# EAGLE design Nu_Duo (EAGLE 6.3)
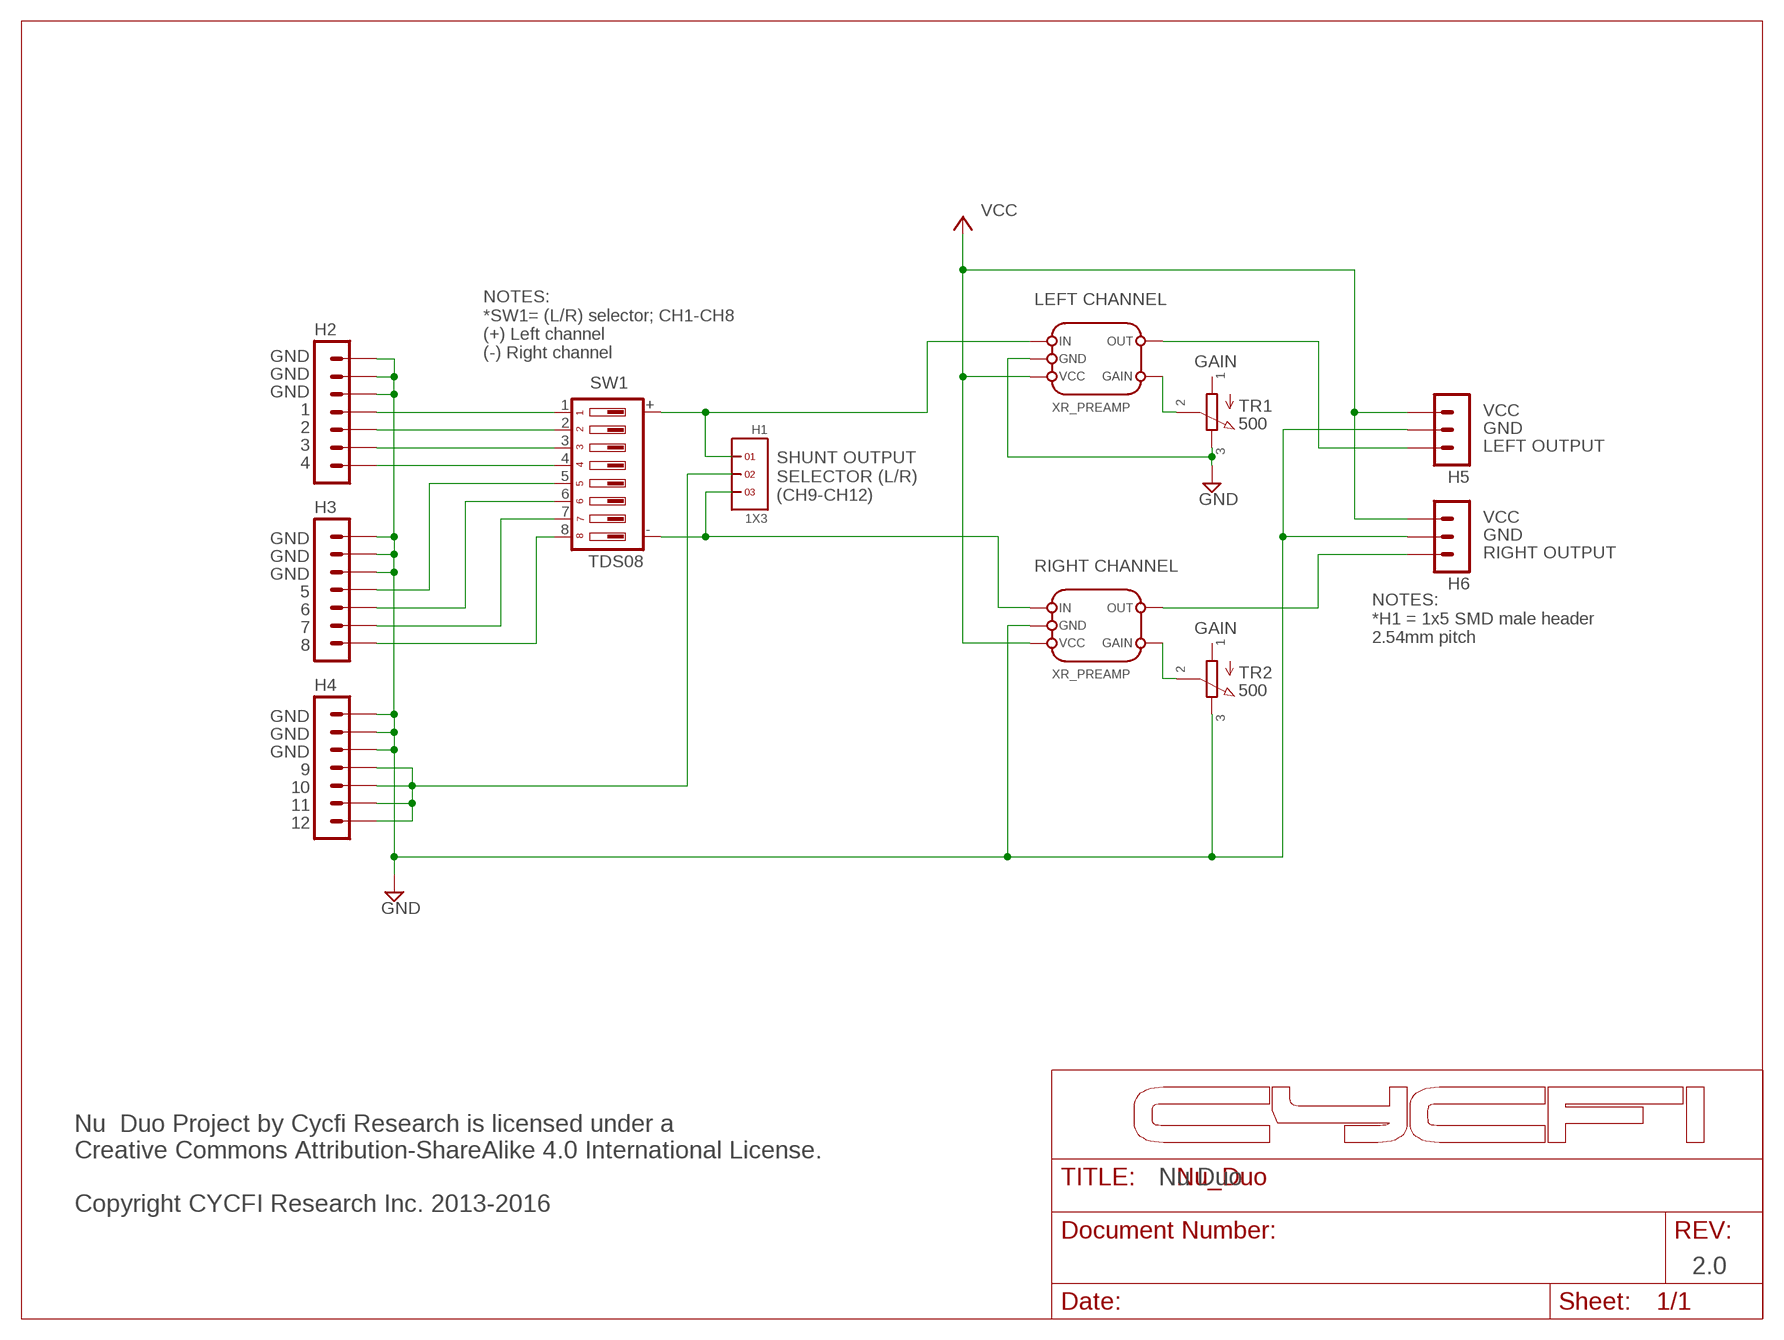
[diagram p0: schematic, sheet 1]

## Parts
H1  1X3  [1X3]
H2  7P_ZIF_59453-071110EDHLF  [7P_ZIF_59453-071110EDHLF]
H3  7P_ZIF_59453-071110EDHLF  [7P_ZIF_59453-071110EDHLF]
H4  7P_ZIF_59453-071110EDHLF  [7P_ZIF_59453-071110EDHLF]
H5  3PIN-SMD-2.54MM  [3P-SMD-2.54MM]
H6  3PIN-SMD-2.54MM  [3P-SMD-2.54MM]
P1  XR_PREAMP  [XR_PREAMP_V1.5]
P2  XR_PREAMP  [XR_PREAMP_V1.5]
SW1  TDS08  [SPDT-08]
TR1  500  TC33X-2-201E  [TC33X-2-201E]
TR2  500  TC33X-2-201E  [TC33X-2-201E]

## Nets
GND: H2.P$5 H2.P$6 H2.P$7 H3.P$5 H3.P$6 H3.P$7 H4.P$5 H4.P$6 H4.P$7 H5.P$2 H6.P$2 P1.GND P2.GND TR1.P$3 TR2.P$3
LO: H6.P$3 P2.OUT
N$1: P1.GAIN TR1.P$2
N$2: P2.GAIN TR2.P$2
N$5: H1.2 H4.P$1 H4.P$2 H4.P$3 H4.P$4
N$6: H1.1 P1.IN SW1.+
N$7: H1.3 P2.IN SW1.-
N$8: H2.P$4 SW1.1
N$9: H2.P$3 SW1.2
N$10: H2.P$2 SW1.3
N$11: H2.P$1 SW1.4
N$12: H3.P$4 SW1.5
N$13: H3.P$3 SW1.6
N$14: H3.P$2 SW1.7
N$15: H3.P$1 SW1.8
RO: H5.P$3 P1.OUT
VCC: H5.P$1 H6.P$1 P1.VCC P2.VCC
Unconnected: TR1.P$1 TR2.P$1

## Notes on the sheet
- LEFT CHANNEL
- GND
- NOTES:
  *SW1= (L/R) selector; CH1-CH8 
  (+) Left channel 
  (-) Right channel
- GND | GAIN
- GND
- 1
- 2 | VCC
- 3 | GND
- 4 | LEFT OUTPUT
- SHUNT OUTPUT 
  SELECTOR (L/R)
  (CH9-CH12)
- VCC
- GND
- GND
- GND
- RIGHT OUTPUT
- GND | RIGHT CHANNEL
- 5
- 6
- 7
- 8 | GAIN
- NOTES:
  *H1 = 1x5 SMD male header
  2.54mm pitch
- GND
- GND
- GND
- 9
- 10
- 11
- 12
- Nu Duo
- Nu  Duo Project by Cycfi Research is licensed under a 
  Creative Commons Attribution-ShareAlike 4.0 International License. 
  
  Copyright CYCFI Research Inc. 2013-2016
- 2.0

## Library data of the parts
H1 = headers(2mm):1X3
H2-H4 = CYCFI_Con:7P_ZIF_59453-071110EDHLF
H5 H6 = CYCFI_Con:3PIN-SMD-2.54MM
P1 P2 = CYCFI_Module_castellated:XR_PREAMP
SW1 = CYCFI_switch:TDS08
TR1 TR2 = CYCFI_Passive:TC33X-2-201E

## Board
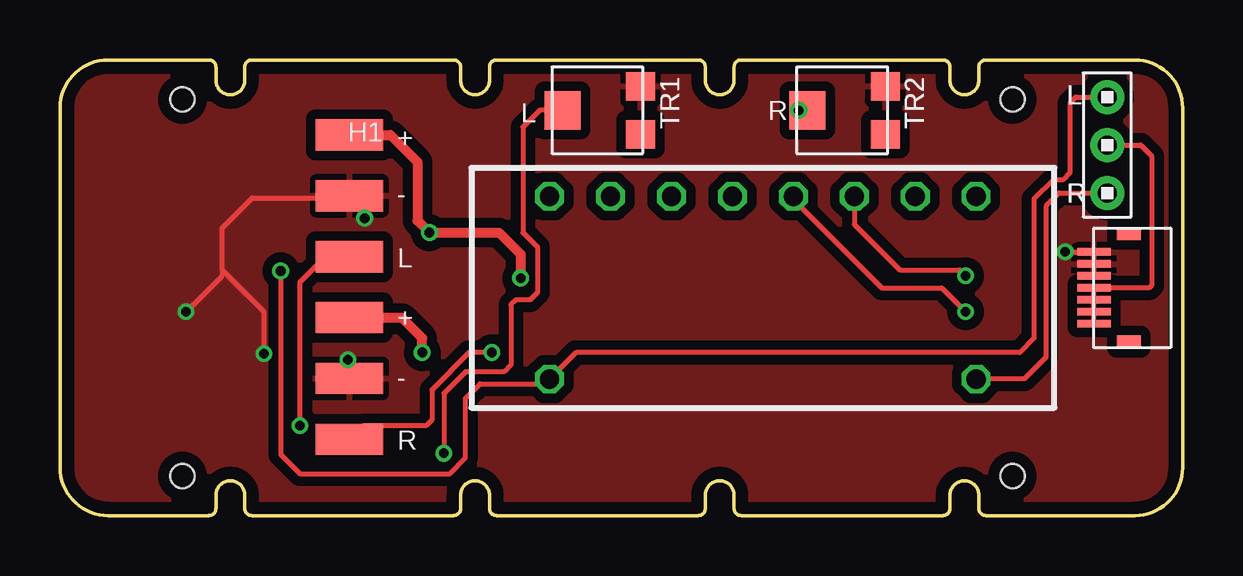
[diagram p1: board, top side]
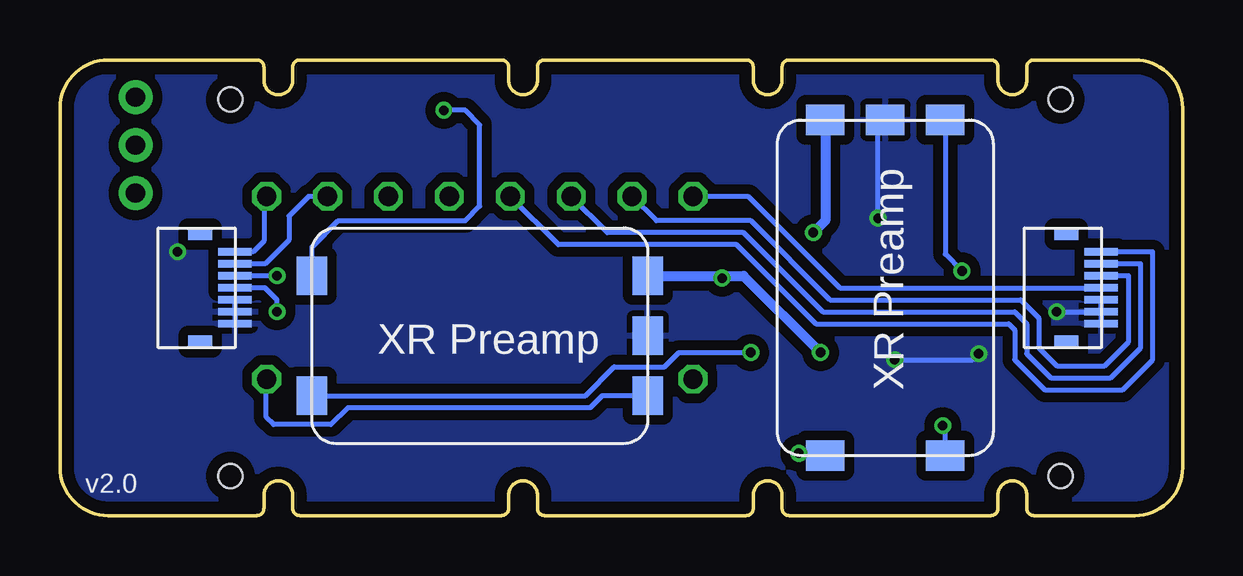
[diagram p2: board, bottom side, seen from below]

Size 46.8 x 19 mm. Coordinates in mm from the lower left corner, seen from the top.
Outline: 6.5,18.15 6.5,18.7 arc90 6.2,19 2,19 arc90 0,17 0,2 arc90 2,0 6.2,0 arc90 6.5,0.3 6.5,0.85 arc-90 7.1,1.45 arc-90 7.7,0.85 7.7,0.3 arc90 8,0 16.4,0 arc90 16.7,0.3 16.7,0.85 arc-90 17.3,1.45 arc-90 17.9,0.85 17.9,0.3 arc90 18.2,0 26.6,0 arc90 26.9,0.3 26.9,0.85 arc-90 27.5,1.45 arc-90 28.1,0.85 28.1,0.3 arc90 28.4,0 36.8,0 arc90 37.1,0.3 37.1,0.85 arc-90 37.7,1.45 arc-90 38.3,0.85 38.3,0.3 arc90 38.6,0 44.8,0 arc90 46.8,2 46.8,17 arc90 44.8,19 38.6,19 arc90 38.3,18.7 38.3,18.15 arc-90 37.7,17.55 arc-90 37.1,18.15 37.1,18.7 arc90 36.8,19 28.4,19 arc90 28.1,18.7 28.1,18.15 arc-90 27.5,17.55 arc-90 26.9,18.15 26.9,18.7 arc90 26.6,19 18.2,19 arc90 17.9,18.7 17.9,18.15 arc-90 17.3,17.55 arc-90 16.7,18.15 16.7,18.7 arc90 16.4,19 8,19 arc90 7.7,18.7 7.7,18.15 arc-90 7.1,17.55 arc-90 6.5,18.15
Copper layers (1*16): Top 0.035mm / dielectric 1.6mm / Bottom 0.035mm
Design rules "Elecrow_2-layer_PCB_eagle_rule": minimum track width 6mil, minimum drill 12mil, track to track 6mil, track to pad 8mil, pad to pad 12mil, via to via 12mil, smd to smd 0mil, copper to edge 20mil, drill to drill 10mil, minimum pad ring 6mil, minimum via ring 6mil, stop-mask expansion 0mil, vias tented up to drill 100mil, thermal gap 10mil
Holes 1 mm at 5.1,17.35 5.1,1.65 39.7,17.35 39.7,1.65

### Footprints (pad centres in the part's own frame; a part is rotated, then mirrored left to right if it is on the bottom)
1X3 = drill 0.8 pad 1.422: 1 -2,0; 2 0,0; 3 2,0
7P_ZIF_59453-071110EDHLF = smd 0.3 x 1.4: P$1 -1.5,1.6; P$2 -1,1.6; P$3 -0.5,1.6; P$4 0,1.6; P$5 0.5,1.6; P$6 1,1.6; P$7 1.5,1.6 | smd 0.52 x 1: ST1 -2.24,0.15; ST2 2.24,0.15
3P-SMD-2.54MM = smd 1.3 x 2.8: P$1 -2.54,0; P$2 0,0; P$3 2.54,0
XR_PREAMP_V1.5 = smd 1.27 x 1.6: GAIN 7,-2.5; GND -7,0; IN -7,2.5; OUT 7,2.5; VCC -7,-2.5
SPDT-08 = drill 0.8 octagon: 1 -8.89,3.81; 2 -6.35,3.81; 3 -3.81,3.81; 4 -1.27,3.81; 5 1.27,3.81; 6 3.81,3.81; 7 6.35,3.81; 8 8.89,3.81; + -8.89,-3.81; - 8.89,-3.81
TC33X-2-201E = smd 1.2 x 1.2: P$1 -1,-1.8; P$3 1,-1.8 | smd 1.6 x 1.5: P$2 0,1.45

### Placement (x,y rotation side)
H1  43.65,15.45 270 top
H2  5,9.5 270 bottom
H3  41.1,9.5 270 bottom
H4  44.7,9.5 90 top
H5  12.06,13.34 270 top
H6  12.06,5.71 270 top
P1  12.4,9.5 270 bottom
P2  29.3,7.5 180 bottom
SW1  29.3,9.5 0 top
TR1  22.4,16.9 90 top
TR2  32.6,16.9 90 top

### Tracks (layer width: path | path; a pad name or v marks a point on that pad's centre or on a via)
GND  (via drill 0.4)
  Top 0.203: v41.9,11 H4.P$7 H4.P$6 H4.P$5 | H6.P$2 12.06,6.43 v12,6.5 | v8.5,6.75 8.5,8.5 6.75,10.25 | 6.75,10.25 6.75,12 8,13.25 11.98,13.25 H5.P$2 12.7,12.7 v12.7,12.4 | 6.75,10.25 6.75,10 v5.25,8.5
  Bottom 0.203: v12.7,12.4 12.7,16.2 P1.GND | v12,6.5 8.75,6.5 v8.5,6.75 | v5.25,8.5 H2.P$6 | H2.P$6 H2.P$7 | H3.P$7 H3.P$6 H3.P$5 | H2.P$6 H2.P$5
  pour Top (isolate 0.406): 44.8,0 2,0 arc-90 0,2 0,17 arc-90 2,19 44.8,19 arc-90 46.8,17 46.8,2 arc-90
  pour Bottom (isolate 0.406): 44.8,0 2,0 arc-90 0,2 0,17 arc-90 2,19 44.8,19 arc-90 46.8,17 46.8,2 arc-90
LO  (via drill 0.4)
  Top 0.203: v18,6.8 17.05,6.8 15.5,5.25 15.5,4 15.25,3.75 12.64,3.75 H6.P$3
  Bottom 0.203: P2.OUT 24.9,5 23.7,6.2 21.6,6.2 21,6.8 v18,6.8
N$1  (via drill 0.4)
  Top 0.203: TR1.P$2 20,16.9 19.3,16.2 19.3,11.8 19.9,11.2 19.9,9.3 19.6,9 19,9 18.8,8.8 18.8,6.3 18.5,6 16.9,6 16,5.1 v16,2.6
  Bottom 0.203: v16,2.6 15,2.6 P1.GAIN
N$2  (via drill 0.4)
  Top 0.203: v30.8,16.9 TR2.P$2
  Bottom 0.203: P2.GAIN 36.3,11.2 35.2,12.3 29.9,12.3 29.3,12.9 29.3,16.3 29.9,16.9 v30.8,16.9
N$5
  Top 0.203: H4.P$1 H4.P$2 H4.P$3 H4.P$4 45.4,9.5 45.5,9.6 45.5,15 45.05,15.45 H1.2
N$6  (via drill 0.4)
  Top 0.203: v9.2,10.2 9.2,2.55 10,1.75 16.25,1.75 16.9,2.4 16.9,4.9 17.5,5.5 20.22,5.5 SW1.+ 21.52,6.8 40,6.8 40.6,7.4 40.6,13.2 41.4,14 41.8,14 42.1,14.3 42.1,17.2 42.35,17.45 H1.1
  Bottom 0.203: P1.IN 9.9,10.9 v9.2,10.2
N$7
  Top 0.203: SW1.- 40.2,5.7 41.1,6.6 41.1,12.9 41.65,13.45 H1.3
  Bottom 0.203: P2.IN 24.2,5 24.7,4.5 34.8,4.5 35.5,3.8 37.9,3.8 38.2,4.1 SW1.-
N$8
  Bottom 0.203: SW1.1 18.1,13.3 14.3,9.5 H2.P$4
N$9
  Bottom 0.203: SW1.2 21.94,12.3 18,12.3 14.7,9 6.75,9 6,8.25 6,7 5.25,6.25 3.25,6.25 2.25,7.25 2.25,10 H2.P$3
N$10
  Bottom 0.203: SW1.3 23.98,11.8 18.3,11.8 15,8.5 7,8.5 6.5,8 6.5,6.75 5.5,5.75 3,5.75 1.75,7 1.75,10.5 H2.P$2
N$11
  Bottom 0.203: SW1.4 26.02,11.3 18.6,11.3 15.3,8 7.25,8 7,7.75 7,6.5 5.75,5.25 2.5,5.25 1.25,6.5 1.25,11 H2.P$1
N$12  (via drill 0.4)
  Top 0.203: SW1.5 30.57,13.18 34.25,9.5 36.75,9.5 v37.75,8.5
  Bottom 0.203: v37.75,8.5 37.75,9 38.25,9.5 H3.P$4
N$13  (via drill 0.4)
  Top 0.203: SW1.6 33.11,12.14 35,10.25 37.5,10.25 v37.75,10
  Bottom 0.203: v37.75,10 H3.P$3
N$14
  Bottom 0.203: SW1.7 36.44,13.31 37.25,12.5 37.25,11.5 38.25,10.5 H3.P$2
N$15
  Bottom 0.203: SW1.8 38.3,13.2 38.3,11.45 38.75,11 H3.P$1
RO  (via drill 0.4)
  Top 0.203: v10,3.75 10,9.75 11,10.75 12.02,10.75 H5.P$3
  Bottom 0.203: P1.OUT 9.9,3.65 v10,3.75
VCC  (via drill 0.4)
  Top 0.406: v19.2,9.9 19.2,10.9 18.3,11.8 v15.4,11.8 14.9,12.3 14.9,14.75 13.78,15.88 H5.P$1 | v15.1,6.8 15.1,7.4 14.25,8.25 H6.P$1
  Bottom 0.406: P2.VCC 19.2,10 | 19.2,10 18.3,10 v15.1,6.8 | P1.VCC 14.9,12.3 v15.4,11.8 | v19.2,9.9 19.2,10

### Text on the board
tNames: L | L | R | + | - | R | L | + | - | R
bNames: v2.0
_tNames: TR1 | TR1 | TR2 | TR2 | L | L | H1 | R | R